# Altium schematic sheet FPGA_7Seg_Decoder.SchDoc: LiveDesign Evaluation - Port Switcher
size A4; Organization: Altium Limited; Address1: L3, 12a Rodborough Rd; Address2: Frenchs Forest; Address3: NSW; Address4: Australia 2086; DocumentNumber: 4; SheetNumber: 4; SheetTotal: 5
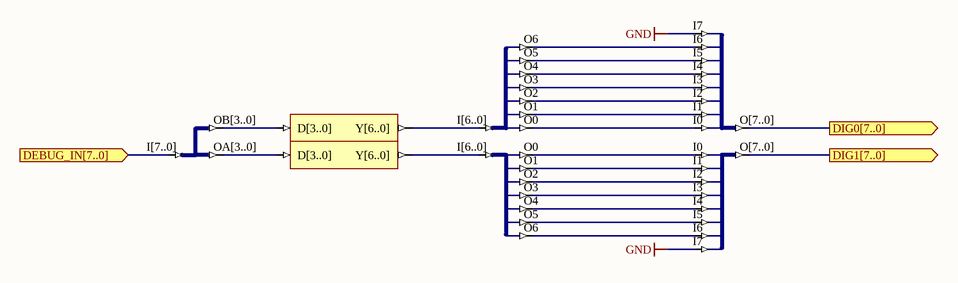
[diagram p0: FPGA_7Seg_Decoder.SchDoc]

## Parts
U17  J8S_8B  (value not drawn)
U18  J8S_8B  (value not drawn)
U23  J7B_7S  (value not drawn)
U24  J7B_7S  (value not drawn)
U28  D7SEGB  (value not drawn)
U29  D7SEGB  (value not drawn)
U32  J8B_4B2  (value not drawn)

## Ports
DEBUG_IN[7..0] (in), DIG0[7..0] (out), DIG1[7..0] (out)

## Nets
GND: U17.I7 U18.I7
DEBUG_IN[7..0]: U32.I[7..0] ; port DEBUG_IN[7..0]
DIG0[7..0]: U17.O[7..0] ; port DIG0[7..0]
DIG1[7..0]: U18.O[7..0] ; port DIG1[7..0]
NetU17_I0: U17.I0 U23.O0
NetU17_I1: U17.I1 U23.O1
NetU17_I2: U17.I2 U23.O2
NetU17_I3: U17.I3 U23.O3
NetU17_I4: U17.I4 U23.O4
NetU17_I5: U17.I5 U23.O5
NetU17_I6: U17.I6 U23.O6
NetU18_I0: U18.I0 U24.O0
NetU18_I1: U18.I1 U24.O1
NetU18_I2: U18.I2 U24.O2
NetU18_I3: U18.I3 U24.O3
NetU18_I4: U18.I4 U24.O4
NetU18_I5: U18.I5 U24.O5
NetU18_I6: U18.I6 U24.O6
NetU23_I[6..0]: U23.I[6..0] U28.Y[6..0]
NetU24_I[6..0]: U24.I[6..0] U29.Y[6..0]
NetU28_D[3..0]: U28.D[3..0] U32.OB[3..0]
NetU29_D[3..0]: U29.D[3..0] U32.OA[3..0]

## Notes on the sheet
- Title
- Size:
- Date:
- A4
- Number:
- Time:
- Revision:
- Sheet
- of
- File:

## Library data of the parts
U17 U18 = J8S_8B: 8 Single pin inputs to single 8-Bit output bus; ArchiveName: GENERIC; VHDLIB_SIM: GENERIC_LIB; Published: 29-Jan-2004; Publisher: Altium Limited; Core Revision: 1.00.00
U23 U24 = J7B_7S: 7-Bit input bus to 7 Single pin outputs; ArchiveName: GENERIC; VHDLIB_SIM: GENERIC_LIB; Published: 29-Jan-2004; Publisher: Altium Limited; Core Revision: 1.00.00
U28 U29 = D7SEGB: 7-Segment-Display Decoder for Common-Cathode LED (Active High Output), Bus Version; ArchiveName: GENERIC; VHDLIB_SIM: GENERIC_LIB; Published: 29-Jan-2004; Publisher: Altium Limited; Core Revision: 1.00.00
U32 = J8B_4B2: 1 x 8-bit input bus to 2 x 4-Bit output bus; ArchiveName: GENERIC; VHDLIB_SIM: GENERIC_LIB; Published: 29-Jan-2004; Publisher: Altium Limited; Core Revision: 1.00.00